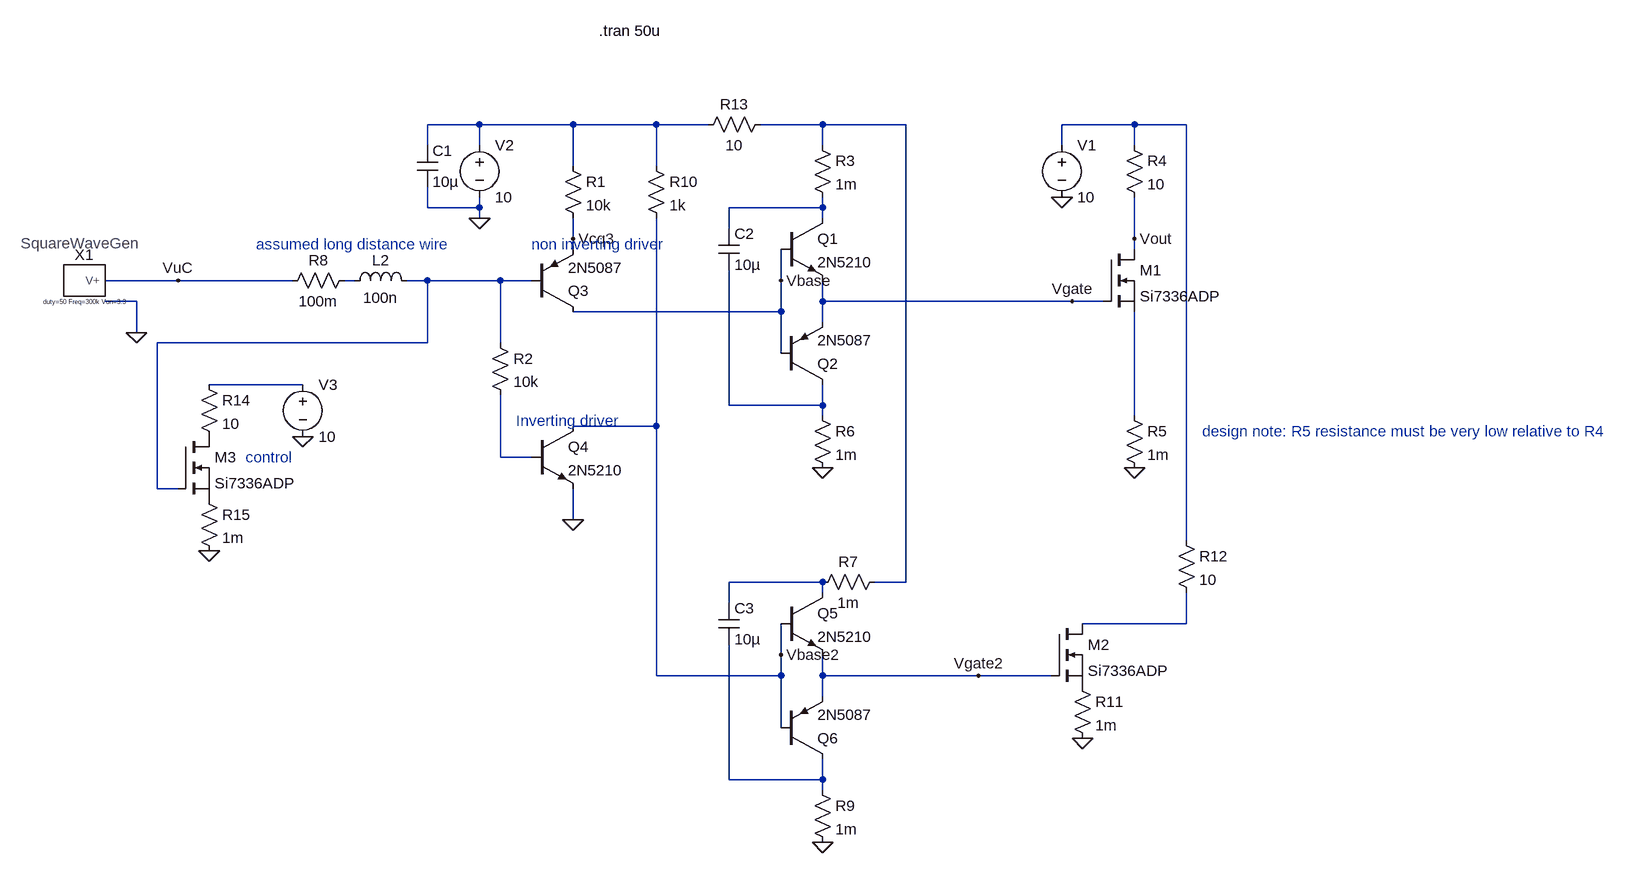
[diagram p0: schematic totempole.asc]
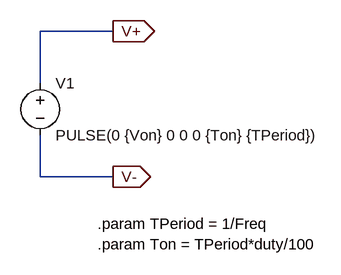
[diagram p1: sub-circuit swgen.asc]
totempole.asc, the LTspice schematic file:
Version 4
SHEET 1 1680 1044
WIRE -112 -80 -192 -80
WIRE 32 -80 -112 -80
WIRE 160 -80 32 -80
WIRE 240 -80 160 -80
WIRE 416 -80 320 -80
WIRE 544 -80 416 -80
WIRE 896 -80 784 -80
WIRE 976 -80 896 -80
WIRE -192 -48 -192 -80
WIRE -112 -48 -112 -80
WIRE 416 -48 416 -80
WIRE 784 -48 784 -80
WIRE 896 -48 896 -80
WIRE 32 -16 32 -80
WIRE 160 -16 160 -80
WIRE -192 48 -192 16
WIRE -112 48 -112 32
WIRE -112 48 -192 48
WIRE 416 48 416 32
WIRE 416 48 272 48
WIRE -112 64 -112 48
WIRE 416 64 416 48
WIRE 272 80 272 48
WIRE 32 96 32 64
WIRE 896 96 896 32
WIRE 32 112 32 96
WIRE 896 112 896 96
WIRE -576 160 -688 160
WIRE -400 160 -576 160
WIRE -304 160 -320 160
WIRE -192 160 -224 160
WIRE -80 160 -192 160
WIRE -32 160 -80 160
WIRE 352 160 352 112
WIRE -640 192 -688 192
WIRE 416 192 416 160
WIRE 800 192 416 192
WIRE 848 192 800 192
WIRE 352 208 352 160
WIRE 352 208 32 208
WIRE 416 224 416 192
WIRE -640 240 -640 192
WIRE -192 256 -192 160
WIRE -192 256 -608 256
WIRE -80 256 -80 160
WIRE 352 272 352 208
WIRE -384 320 -528 320
WIRE 272 352 272 144
WIRE 416 352 416 320
WIRE 416 352 272 352
WIRE 416 368 416 352
WIRE 896 368 896 208
WIRE 160 384 160 64
WIRE 160 384 32 384
WIRE -80 432 -80 336
WIRE -32 432 -80 432
WIRE -608 480 -608 256
WIRE -576 480 -608 480
WIRE 32 528 32 480
WIRE 976 560 976 -80
WIRE 416 624 272 624
WIRE 544 624 544 -80
WIRE 544 624 496 624
WIRE 416 640 416 624
WIRE 272 656 272 624
WIRE 976 688 976 640
WIRE 976 688 816 688
WIRE 352 736 352 688
WIRE 160 768 160 384
WIRE 352 768 352 736
WIRE 352 768 160 768
WIRE 416 768 416 736
WIRE 656 768 416 768
WIRE 768 768 656 768
WIRE 416 800 416 768
WIRE 352 848 352 768
WIRE 272 928 272 720
WIRE 416 928 416 896
WIRE 416 928 272 928
WIRE 416 944 416 928
FLAG 416 448 0
FLAG -112 64 0
FLAG 896 448 0
FLAG -640 240 0
FLAG 896 96 Vout
FLAG -576 160 VuC
FLAG 352 160 Vbase
FLAG 800 192 Vgate
FLAG 784 32 0
FLAG 32 96 Vcq3
FLAG 32 528 0
FLAG 416 1024 0
FLAG 352 736 Vbase2
FLAG 656 768 Vgate2
FLAG 816 864 0
FLAG -528 576 0
FLAG -384 400 0
SYMBOL npn 352 64 R0
SYMATTR InstName Q1
SYMATTR Value 2N5210
SYMBOL pnp 352 320 M180
SYMATTR InstName Q2
SYMATTR Value 2N5087
SYMBOL voltage -112 -64 R0
WINDOW 123 0 0 Left 0
WINDOW 39 0 0 Left 0
SYMATTR InstName V2
SYMATTR Value 10
SYMBOL nmos 848 112 R0
SYMATTR InstName M1
SYMATTR Value Si7336ADP
SYMBOL res 400 -64 R0
SYMATTR InstName R3
SYMATTR Value 1m
SYMBOL res 880 -64 R0
SYMATTR InstName R4
SYMATTR Value 10
SYMBOL res 880 352 R0
SYMATTR InstName R5
SYMATTR Value 1m
SYMBOL res 400 352 R0
SYMATTR InstName R6
SYMATTR Value 1m
SYMBOL res -304 144 R90
WINDOW 0 0 56 VBottom 2
WINDOW 3 32 56 VTop 2
SYMATTR InstName R8
SYMATTR Value 100m
SYMBOL ind -320 176 R270
WINDOW 0 32 56 VTop 2
WINDOW 3 5 56 VBottom 2
SYMATTR InstName L2
SYMATTR Value 100n
SYMBOL swgen -720 160 R0
SYMATTR InstName X1
SYMATTR SpiceLine duty=50 Freq=300k Von=3.3
SYMBOL voltage 784 -64 R0
WINDOW 123 0 0 Left 0
WINDOW 39 0 0 Left 0
SYMATTR InstName V1
SYMATTR Value 10
SYMBOL pnp -32 208 M180
SYMATTR InstName Q3
SYMATTR Value 2N5087
SYMBOL res 16 -32 R0
SYMATTR InstName R1
SYMATTR Value 10k
SYMBOL cap -208 -48 R0
SYMATTR InstName C1
SYMATTR Value 10µ
SYMBOL cap 256 80 R0
SYMATTR InstName C2
SYMATTR Value 10µ
SYMBOL npn -32 384 R0
SYMATTR InstName Q4
SYMATTR Value 2N5210
SYMBOL res -96 240 R0
SYMATTR InstName R2
SYMATTR Value 10k
SYMBOL npn 352 640 R0
SYMATTR InstName Q5
SYMATTR Value 2N5210
SYMBOL pnp 352 896 M180
SYMATTR InstName Q6
SYMATTR Value 2N5087
SYMBOL res 512 608 R90
WINDOW 0 0 56 VBottom 2
WINDOW 3 32 56 VTop 2
SYMATTR InstName R7
SYMATTR Value 1m
SYMBOL res 400 928 R0
SYMATTR InstName R9
SYMATTR Value 1m
SYMBOL cap 256 656 R0
SYMATTR InstName C3
SYMATTR Value 10µ
SYMBOL res 144 -32 R0
SYMATTR InstName R10
SYMATTR Value 1k
SYMBOL nmos 768 688 R0
SYMATTR InstName M2
SYMATTR Value Si7336ADP
SYMBOL res 800 768 R0
SYMATTR InstName R11
SYMATTR Value 1m
SYMBOL res 960 544 R0
SYMATTR InstName R12
SYMATTR Value 10
SYMBOL res 336 -96 R90
WINDOW 0 0 56 VBottom 2
WINDOW 3 32 56 VTop 2
SYMATTR InstName R13
SYMATTR Value 10
SYMBOL nmos -576 400 R0
SYMATTR InstName M3
SYMATTR Value Si7336ADP
SYMBOL res -544 304 R0
SYMATTR InstName R14
SYMATTR Value 10
SYMBOL res -544 480 R0
SYMATTR InstName R15
SYMATTR Value 1m
SYMBOL voltage -384 304 R0
WINDOW 123 0 0 Left 0
WINDOW 39 0 0 Left 0
SYMATTR InstName V3
SYMATTR Value 10
TEXT 72 -224 Left 2 !.tran 50u
TEXT 1000 392 Left 2 ;design note: R5 resistance must be very low relative to R4
TEXT -456 104 Left 2 ;assumed long distance wire
TEXT -56 376 Left 2 ;Inverting driver
TEXT -32 104 Left 2 ;non inverting driver
TEXT -472 432 Left 2 ;control

swgen.asc, the sub-circuit schematic file:
Version 4
SHEET 1 880 680
WIRE 208 16 96 16
WIRE 96 96 96 16
WIRE 96 240 96 176
WIRE 208 240 96 240
FLAG 208 16 V+
IOPIN 208 16 Out
FLAG 208 240 V-
IOPIN 208 240 Out
SYMBOL voltage 96 80 R0
WINDOW 123 0 0 Left 0
WINDOW 39 0 0 Left 0
SYMATTR InstName V1
SYMATTR Value PULSE(0 {Von} 0 0 0 {Ton} {TPeriod})
TEXT 184 312 Left 2 !.param TPeriod = 1/Freq
TEXT 184 344 Left 2 !.param Ton = TPeriod*duty/100

The netlist it stands for:
* totempole.asc
Q1 N004 Vbase Vgate 0 2N5210
Q2 N008 Vbase Vgate 0 2N5087
V2 N001 0 10
M1 Vout Vgate N009 N009 Si7336ADP
R3 N002 N004 1m
R4 N003 Vout 10
R5 N009 0 1m
R6 N008 0 1m
R8 N005 VuC 100m
L2 N005 N006 100n
XX1 VuC swgen params: duty=50 Freq=300k Von=3.3
V1 N003 0 10
Q3 Vbase N006 Vcq3 0 2N5087
R1 N001 Vcq3 10k
C1 N001 0 10µ
C2 N004 N008 10µ
Q4 Vbase2 N010 0 0 2N5210
R2 N006 N010 10k
Q5 N011 Vbase2 Vgate2 0 2N5210
Q6 N013 Vbase2 Vgate2 0 2N5087
R7 N002 N011 1m
R9 N013 0 1m
C3 N011 N013 10µ
R10 N001 Vbase2 1k
M2 N012 Vgate2 P001 P001 Si7336ADP
R11 P001 0 1m
R12 N003 N012 10
R13 N002 N001 10
M3 P002 N006 P003 P003 Si7336ADP
R14 N007 P002 10
R15 P003 0 1m
V3 N007 0 10

* block symbol definitions
.subckt swgen V+
V1 V+ V- PULSE(0 {Von} 0 0 0 {Ton} {TPeriod})
.param TPeriod = 1/Freq
.param Ton = TPeriod*duty/100
.ends swgen

.model NPN NPN
.model PNP PNP
.lib standard.bjt
.model NMOS NMOS
.model PMOS PMOS
.lib standard.mos
.tran 50u
* design note: R5 resistance must be very low relative to R4
* assumed long distance wire
* Inverting driver
* non inverting driver
* control
.backanno
.end